# EAGLE design bga_test (EAGLE 6.4)
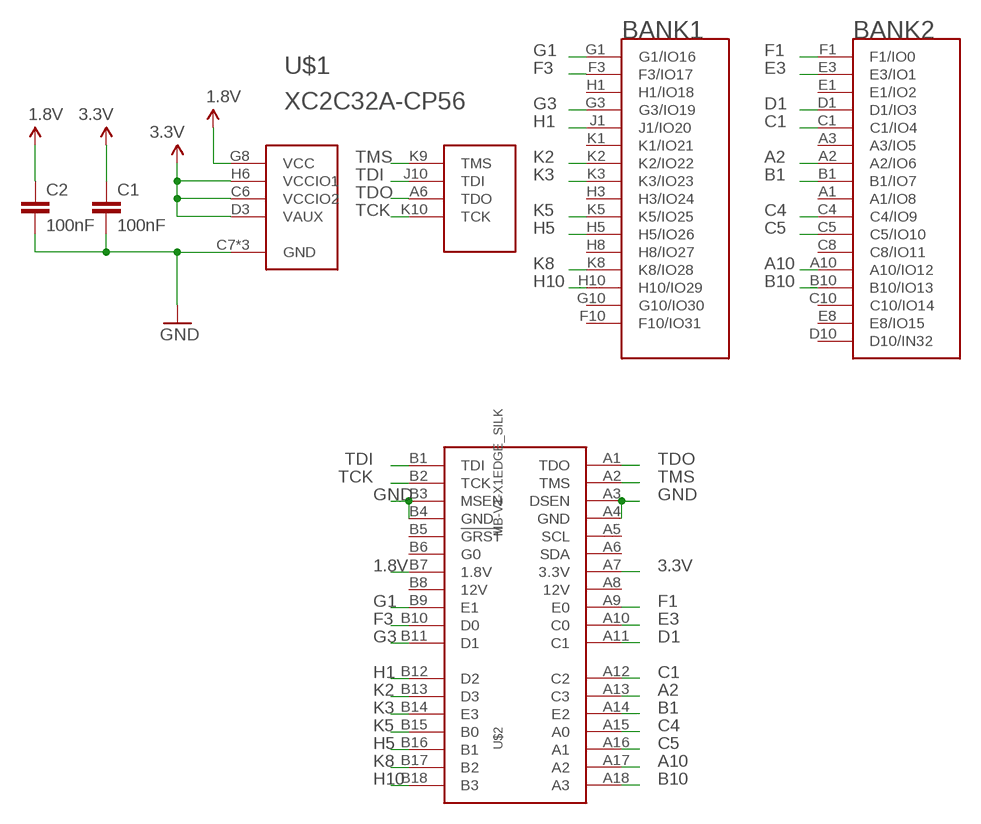
[diagram p0: schematic, sheet 1]

## Parts
C1  100nF  CAP0402-CAP  [0402-CAP]
C2  100nF  CAP0402-CAP  [0402-CAP]
U$1  XC2C32A-CP56  [XILINX_CP56]
U$2  MB-V1-X1EDGE_SILK  [MB-V1-X1-EDGE]

## Nets
1.8V: C2.1 U$1.G8(VCC) U$2.B7(1.8V)
3.3V: C1.1 U$1.C6(VCCIO2) U$1.D3(VAUX) U$1.H6(VCCIO1) U$2.A7(3.3V)
A2: U$1.A2(A2/IO6) U$2.A13(C3)
A10: U$1.A10(A10/IO12) U$2.A17(A2)
B1: U$1.B1(B1/IO7) U$2.A14(E2)
B10: U$1.B10(B10/IO13) U$2.A18(A3)
C1: U$1.C1(C1/IO4) U$2.A12(C2)
C4: U$1.C4(C4/IO9) U$2.A15(A0)
C5: U$1.C5(C5/IO10) U$2.A16(A1)
D1: U$1.D1(D1/IO3) U$2.A11(C1)
E3: U$1.E3(E3/IO1) U$2.A10(C0)
F1: U$1.F1(F1/IO0) U$2.A9(E0)
F3: U$1.F3(F3/IO17) U$2.B10(D0)
G1: U$1.G1(G1/IO16) U$2.B9(E1)
G3: U$1.G3(G3/IO19) U$2.B11(D1)
GND: C1.2 C2.2 U$1.C7(GND) U$1.F8(GND) U$1.H4(GND) U$2.A3(DSEN) U$2.A4(GND) U$2.B3(MSEN) U$2.B4(GND)
H1: U$1.J1(J1/IO20) U$2.B12(D2)
H5: U$1.H5(H5/IO26) U$2.B16(B1)
H10: U$1.H10(H10/IO29) U$2.B18(B3)
K2: U$1.K2(K2/IO22) U$2.B13(D3)
K3: U$1.K3(K3/IO23) U$2.B14(E3)
K5: U$1.K5(K5/IO25) U$2.B15(B0)
K8: U$1.K8(K8/IO28) U$2.B17(B2)
TCK: U$1.K10(TCK) U$2.B2(TCK)
TDI: U$1.J10(TDI) U$2.B1(TDI)
TDO: U$1.A6(TDO) U$2.A1(TDO)
TMS: U$1.K9(TMS) U$2.A2(TMS)
Unconnected: U$1.A1(A1/IO8) U$1.A3(A3/IO5) U$1.A4(NC) U$1.A5(NC) U$1.A7(NC) U$1.A8(NC) U$1.A9(NC) U$1.C3(NC) U$1.C8(C8/IO11) U$1.C10(C10/IO14) U$1.D8(NC) U$1.D10(D10/IN32) U$1.E1(E1/IO2) U$1.E8(E8/IO15) U$1.E10(NC) U$1.F10(F10/IO31) U$1.G10(G10/IO30) U$1.H1(H1/IO18) U$1.H3(H3/IO24) U$1.H7(NC) U$1.H8(H8/IO27) U$1.K1(K1/IO21) U$1.K4(NC) U$1.K6(NC) U$1.K7(NC) U$2.A5(SCL) U$2.A6(SDA) U$2.A8(12V) U$2.B5(!GRST) U$2.B6(G0) U$2.B8(12V)

## Library data of the parts
C1 C2 = SparkFun-Capacitors:CAP: Capacitor Standard 0603 ceramic capacitor, and 0.1" leaded capacitor.
U$1 = kmod:XC2C32A-CP56
U$2 = kmod-connectors:MB-V1-X1

## Board
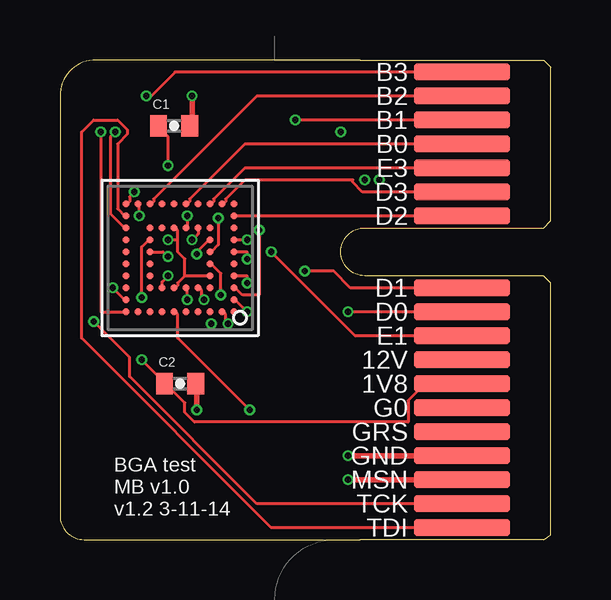
[diagram p1: board, top side]
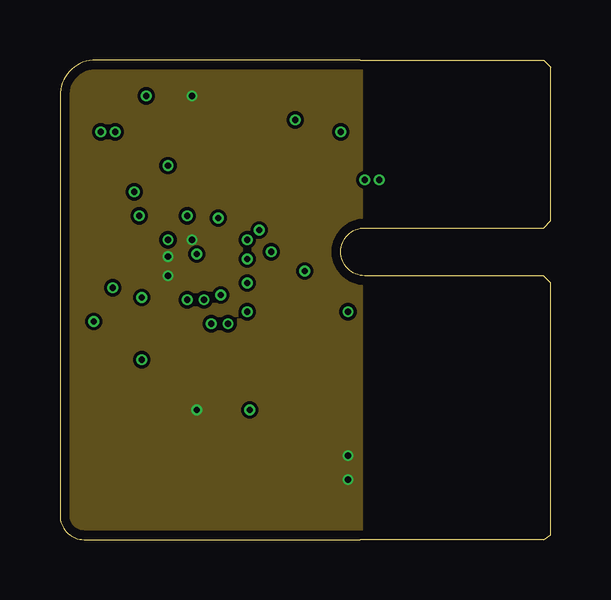
[diagram p2: board, inner layer Route2]
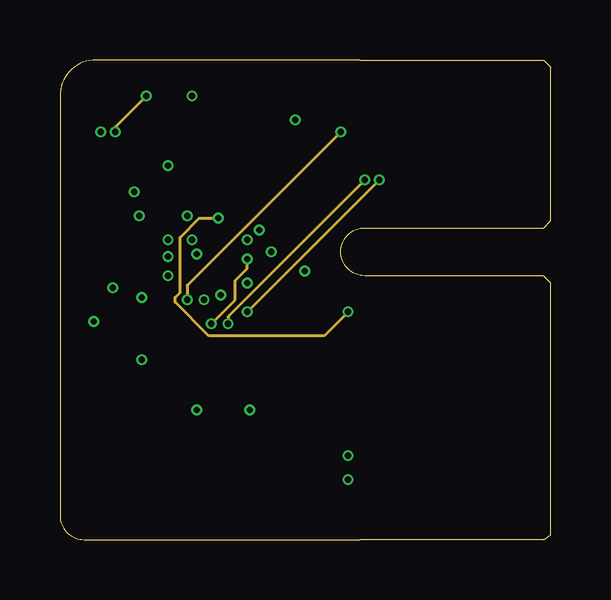
[diagram p3: board, inner layer Route15]
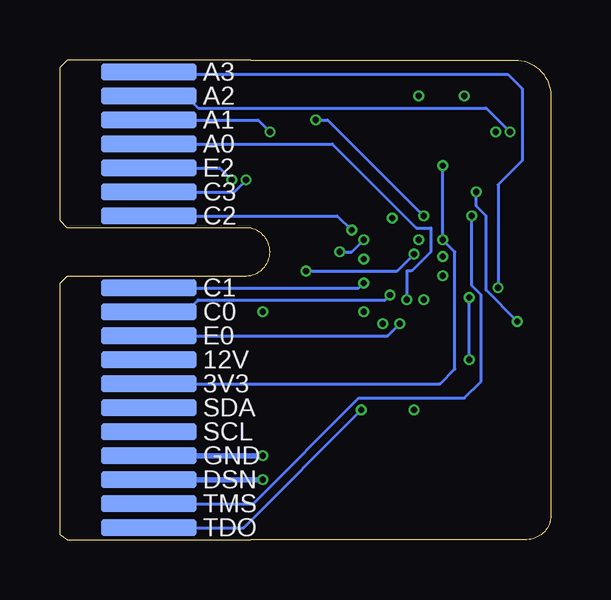
[diagram p4: board, bottom side, seen from below]

Size 20.45 x 20 mm. Coordinates in mm from the lower left corner, seen from the top.
Outline: 12.5,20 1.5,20 arc90 0,18.5 0,1 arc90 1,0 12.5,0
Copper layers (1+2*15+16): Top 0.0356mm / dielectric 0.17mm / Route2 0.0178mm / dielectric 1.1941mm / Route15 0.0178mm / dielectric 0.17mm / Bottom 0.0356mm
Design rules "OSHPark_mine_4layer": minimum track width 5mil, minimum drill 10mil, track to track 5mil, track to pad 5mil, pad to pad 5mil, via to via 5mil, smd to smd 5mil, copper to edge 15mil, drill to drill 6mil, minimum pad ring 4mil, minimum via ring 4mil, stop-mask expansion 2mil, vias tented up to drill 13mil, thermal gap 10mil

### Footprints (pad centres in the part's own frame; a part is rotated, then mirrored left to right if it is on the bottom)
0402-CAP = smd 0.7 x 0.9: 1 -0.65,0; 2 0.65,0
XILINX_CP56 = smd 0.27 x 0.27: A1 2.25,-2.25; A2 1.75,-2.25; A3 1.25,-2.25; A4 0.75,-2.25; A5 0.25,-2.25; A6 -0.25,-2.25; A7 -0.75,-2.25; A8 -1.25,-2.25; A9 -1.75,-2.25; A10 -2.25,-2.25; B1 2.25,-1.75; B10 -2.25,-1.75; C1 2.25,-1.25; C3 1.25,-1.25; C4 0.75,-1.25; C5 0.25,-1.25; C6 -0.25,-1.25; C7 -0.75,-1.25; C8 -1.25,-1.25; C10 -2.25,-1.25; D1 2.25,-0.75; D3 1.25,-0.75; D8 -1.25,-0.75; D10 -2.25,-0.75; E1 2.25,-0.25; E3 1.25,-0.25; E8 -1.25,-0.25; E10 -2.25,-0.25; F1 2.25,0.25; F3 1.25,0.25; F8 -1.25,0.25; F10 -2.25,0.25; G1 2.25,0.75; G3 1.25,0.75; G8 -1.25,0.75; G10 -2.25,0.75; H1 2.25,1.25; H3 1.25,1.25; H4 0.75,1.25; H5 0.25,1.25; H6 -0.25,1.25; H7 -0.75,1.25; H8 -1.25,1.25; H10 -2.25,1.25; J1 2.25,1.75; J10 -2.25,1.75; K1 2.25,2.25; K2 1.75,2.25; K3 1.25,2.25; K4 0.75,2.25; K5 0.25,2.25; K6 -0.25,2.25; K7 -0.75,2.25; K8 -1.25,2.25; K9 -1.75,2.25; K10 -2.25,2.25
MB-V1-X1-EDGE = smd 0.7 x 4 bottom: A1 -11.5,-0.75; A2 -10.5,-0.75; A3 -9.5,-0.75; A4 -8.5,-0.75; A5 -7.5,-0.75; A6 -6.5,-0.75; A7 -5.5,-0.75; A8 -4.5,-0.75; A9 -3.5,-0.75; A10 -2.5,-0.75; A11 -1.5,-0.75; A12 1.5,-0.75; A13 2.5,-0.75; A14 3.5,-0.75; A15 4.5,-0.75; A16 5.5,-0.75; A17 6.5,-0.75; A18 7.5,-0.75 | smd 0.7 x 4: B1 -11.5,-0.75; B2 -10.5,-0.75; B3 -9.5,-0.75; B4 -8.5,-0.75; B5 -7.5,-0.75; B6 -6.5,-0.75; B7 -5.5,-0.75; B8 -4.5,-0.75; B9 -3.5,-0.75; B10 -2.5,-0.75; B11 -1.5,-0.75; B12 1.5,-0.75; B13 2.5,-0.75; B14 3.5,-0.75; B15 4.5,-0.75; B16 5.5,-0.75; B17 6.5,-0.75; B18 7.5,-0.75

### Placement (x,y rotation side)
C1  4.75,17.25 0 top
C2  5,6.5 0 top
U$1  5,11.75 0 top
U$2  16,12 90 top

### Tracks (layer width: path | path; a pad name or v marks a point on that pad's centre or on a via)
1.8V  (via drill 0.25)
  Top 0.127: v3.4,10.1 3.4,12.2 3.7,12.5 U$1.G8 | v3.4,7.5 4.3,6.6 4.3,6.5 C2.1 4.4,6.5 5.2,5.7 5.2,5.3 5.6,4.9 14.5,4.9 14.5,5.8 15.2,6.5 U$2.B7
  Bottom 0.127: v3.4,7.5 v3.4,10.1
3.3V  (via drill 0.25)
  Top 0.127: 5.2,11 4.9,10.7 4.9,10.6 4.8,10.5 U$1.C6 | U$1.D3 5.2,11 | 4.9,12.5 4.9,12 5.2,11.7 5.2,11 | 4.9,12.5 4.9,12.9 4.8,13 U$1.H6 | v4.5,15.6 4.5,16.8 4.1,17.2 C1.1 | 4.9,12.5 v4.5,12.5
  Bottom 0.127: v4.5,15.6 v4.5,12.5 4,12 4,7.11 4.61,6.5 U$2.A7
A2  (via drill 0.25)
  Top 0.127: v7,9 6.9,9.1 6.9,9.4 6.8,9.5 U$1.A2
  Route15 0.127: v7,9 7,9.3 v12.7,15
  Bottom 0.127: v12.7,15 13.2,14.5 U$2.A13
A10  (via drill 0.25)
  Top 0.127: U$1.A10 1.7,9.5 v1.7,17
  Bottom 0.127: v1.7,17 2.7,18 14.7,18 15.2,18.5 U$2.A17
B1  (via drill 0.25)
  Top 0.127: v7.8,9.5 7.3,10 U$1.B1
  Route15 0.127: v13.3,15 v7.8,9.5
  Bottom 0.127: v13.3,15 13.8,15.5 U$2.A14
B10  (via drill 0.25)
  Top 0.127: v2.2,10.5 2.7,10 U$1.B10
  Bottom 0.127: v2.2,10.5 2.2,14.8 1.2,15.8 1.2,18.8 1.8,19.4 16.6,19.4 16.7,19.5 U$2.A18
C1  (via drill 0.25)
  Top 0.127: v8.3,12.9 8.3,10.2 7.6,10.2 7.3,10.5 U$1.C1
  Bottom 0.127: v8.3,12.9 8.9,13.5 U$2.A12
C4  (via drill 0.25)
  Top 0.127: v6,10 5.9,10.1 5.9,10.4 5.8,10.5 U$1.C4
  Bottom 0.127: v6,10 6,11.2 5.8,11.2 5,12 5,13 5.6,13 9.1,16.5 U$2.A15
C5  (via drill 0.25)
  Top 0.127: v5.3,10 5.3,10.5 U$1.C5
  Route15 0.127: v5.3,10 5.3,10.6 v11.7,17
  Bottom 0.127: v11.7,17 12.2,17.5 U$2.A16
D1  (via drill 0.25)
  Top 0.127: U$1.D1 7.8,11 v7.8,10.7
  Bottom 0.127: v7.8,10.7 8,10.5 U$2.A11
E3  (via drill 0.25)
  Top 0.127: v6.7,10.2 6.7,11.1 6.3,11.5 U$1.E3
  Bottom 0.127: v6.7,10.2 6.9,10 14.7,10 15.2,9.5 U$2.A10
F1  (via drill 0.25)
  Top 0.127: U$1.F1 7.8,12 v7.8,11.7
  Route15 0.127: v7.8,11.7 7.8,11.3 7.3,10.8 7.3,10 v6.3,9
  Bottom 0.127: v6.3,9 6.8,8.5 U$2.A9
F3  (via drill 0.25)
  Top 0.127: v6.6,13.4 6.6,12.3 6.3,12 U$1.F3 | U$2.B10 v12,9.5
  Route15 0.127: v6.6,13.4 5.8,13.4 5,12.6 5,10.3 4.8,10.1 4.8,9.9 6.2,8.5 11,8.5 v12,9.5
G1  (via drill 0.25)
  Top 0.127: v7.8,12.5 U$1.G1 | v8.8,12 12.3,8.5 U$2.B9
  Bottom 0.127: v7.8,12.5 8.3,12 v8.8,12
G3  (via drill 0.25)
  Top 0.127: v5.7,11.9 5.7,12 6.2,12.5 U$1.G3 | v10.2,11.2 11.4,11.2 12.1,10.5 U$2.B11
  Bottom 0.127: v5.7,11.9 6.4,11.2 v10.2,11.2
GND  (via drill 0.25)
  Top 0.127: U$1.C7 4.25,10.75 v4.5,11 | U$1.F8 4.3,12 v4.5,11.8 | U$1.H4 5.75,12.75 v5.5,12.5
  Top 0.229: C1.2 5.5,17.25 v5.5,18.5 | C2.2 5.7,6.5 v5.7,5.4 | U$2.A3 v12,2.5 | U$2.A4 v12,3.5
  Bottom 0.229: U$2.A3 v12,2.5 | U$2.A4 v12,3.5
  pour Route2: 0,20 12.5,20 12.5,0 0,0
H1
  Top 0.127: U$2.B12 U$1.J1
H5  (via drill 0.25)
  Top 0.127: v5.3,13.5 5.3,13 U$1.H5 | U$2.B16 v9.8,17.5
  Bottom 0.127: v5.3,13.5 9.3,17.5 v9.8,17.5
H10  (via drill 0.25)
  Top 0.127: v2.3,17 2.1,16.8 2.1,13.6 2.7,13 U$1.H10 | v3.6,18.5 3.8,18.5 4.8,19.5 U$2.B18
  Route15 0.127: v2.3,17 2.3,17.2 v3.6,18.5
K2
  Top 0.127: U$2.B13 12.6,14.5 12.2,14.9 12.2,15 7.7,15 6.9,14.2 6.9,14.1 6.8,14 U$1.K2
K3
  Top 0.127: U$2.B14 7.7,15.5 6.4,14.2 6.4,14.1 6.3,14 U$1.K3
K5
  Top 0.127: U$2.B15 7.7,16.5 5.4,14.2 5.4,14.1 5.3,14 U$1.K5
K8
  Top 0.127: U$2.B17 8.2,18.5 3.9,14.2 3.9,14.1 3.8,14 U$1.K8
TCK  (via drill 0.25)
  Top 0.127: v3.1,14.5 2.9,14.3 2.9,14.1 2.8,14 U$1.K10 | v1.4,9.1 2.9,7.6 2.9,6.8 8.2,1.5 U$2.B2
  Bottom 0.127: v3.1,14.5 3.1,13.9 2.7,13.5 2.7,10.4 v1.4,9.1
TDI
  Top 0.127: U$2.B1 8.8,0.5 0.9,8.4 0.9,17 1.4,17.5 2.4,17.5 2.8,17.1 2.8,16.9 2.4,16.5 2.4,13.8 2.7,13.5 U$1.J10
TDO  (via drill 0.25)
  Top 0.127: v7.9,5.4 4.9,8.4 4.9,9.4 4.8,9.5 U$1.A6
  Bottom 0.127: v7.9,5.4 12.8,0.5 U$2.A1
TMS  (via drill 0.25)
  Top 0.127: v3.3,13.5 3.3,14 U$1.K9
  Bottom 0.127: v3.3,13.5 3.3,10.6 2.9,10.2 2.9,6.6 3.6,5.9 8,5.9 12.4,1.5 U$2.A2

### Text on the board
tPlace: BGA test / MB v1.0 / v1.2 3-11-14